# Altium project PCB_Project1.PrjPCB
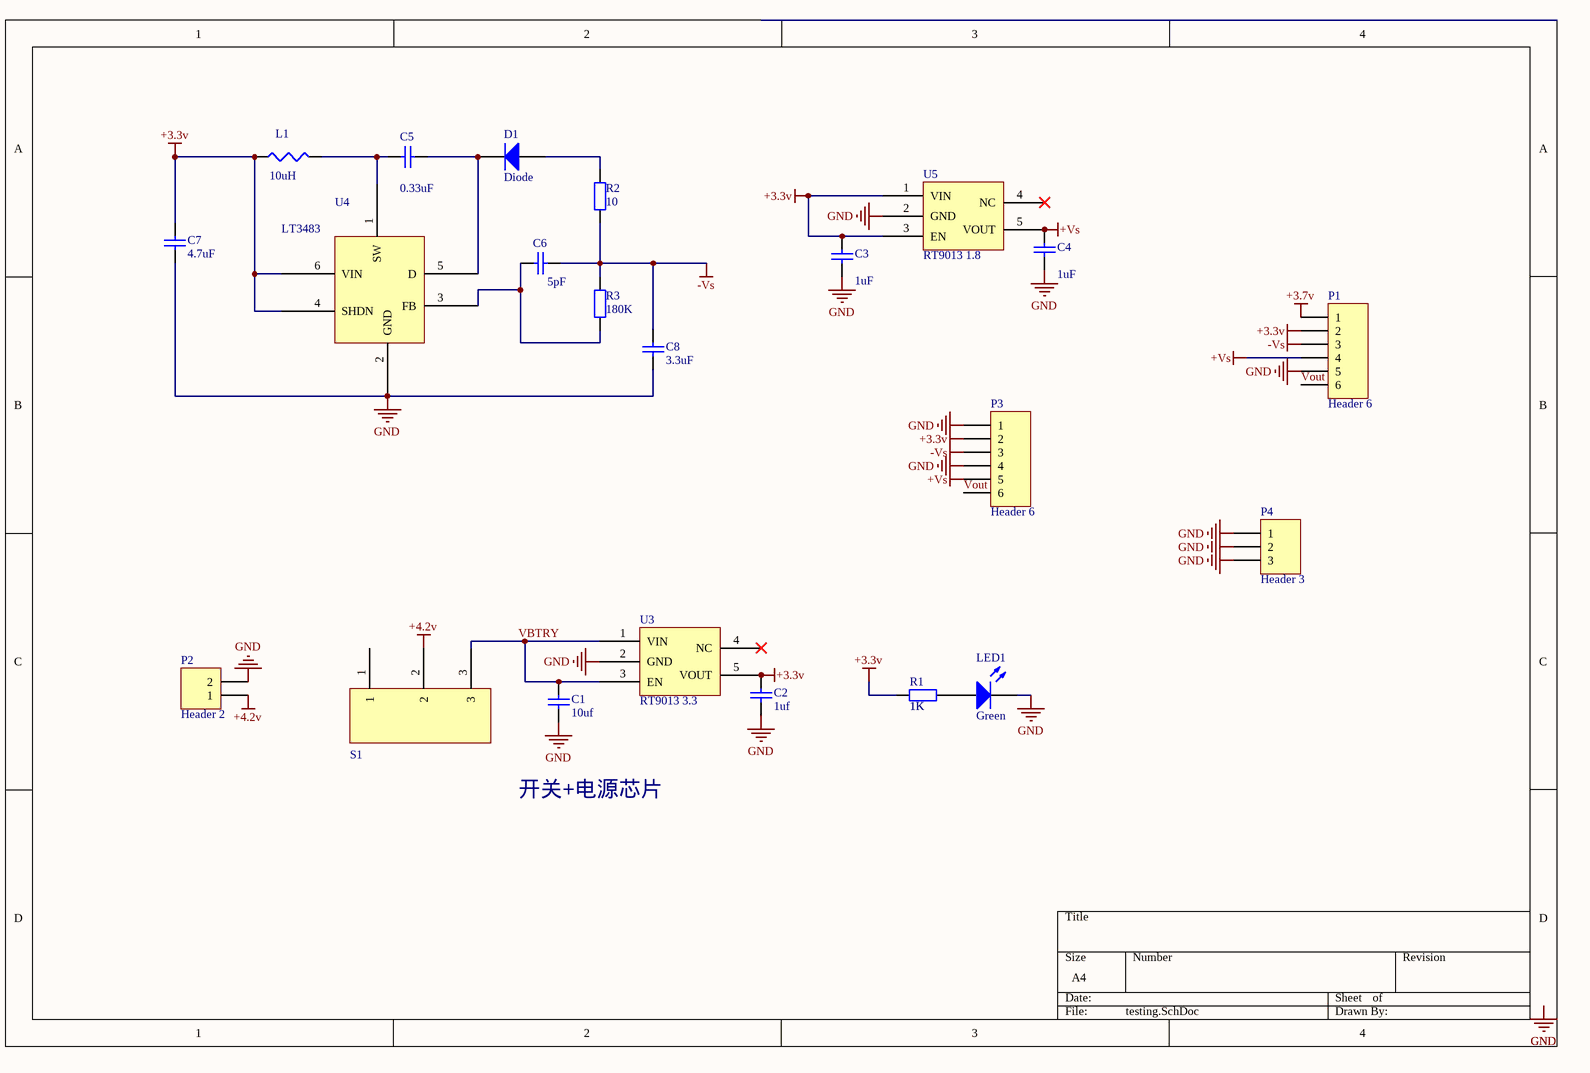
[diagram p0: testing.SchDoc]
1 sheet, 22 parts. Net scope: global (net labels, ports and power ports of the same name join across sheets).
Board file: testing.PcbDoc

## Sheet testing.SchDoc
size A4

### Parts
C1  10uf  [0805]
C2  1uf  [0805]
C3  value 1uF  [0805]
C4  value 1uF  [0805]
C5  value 0.33uF  [0805]  (hidden comment: Cap Semi)
C6  value 5pF  [0805]  (hidden comment: Cap Semi)
C7  value 4.7uF  [0805]  (hidden comment: Cap Semi)
C8  value 3.3uF  [0805]  (hidden comment: Cap Semi)
D1  Diode  [D0402]
L1  value 10uH  [0402 - MI]  (hidden comment: Res3)
LED1  Green  [0805]
P1  Header 6  [6P_0.5mm(FPC) - duplicate - duplicate]
P2  Header 2  [HDR1X2]
P3  Header 6  [HDR1X6]
P4  Header 3  [HDR1X3]
R1  1K  [0805]
R2  10  [0805]
R3  180K  [0805]
S1  (no value)  [HDR1X3]
U3  RT9013 3.3  [SOT23-5AM]
U4  LT3483  [LT3843]
U5  RT9013 1.8  [SC-70-5]

### Nets
+3.3v: C2.2 C3.2 C7.2 L1.1 P1.2 P3.2 R1.1 U3.5(VOUT) U4.4(SHDN) U4.6(VIN) U5.1(VIN) U5.3(EN)
+3.7v: P1.1
+4.2v: P2.1 S1.2
+Vs: C4.2 P1.4 P3.5 U5.5(VOUT)
-Vs: C6.2 C8.1 P1.3 P3.3 R2.2 R3.1
GND: C1.1 C2.1 C3.1 C4.1 C7.1 C8.2 LED1.2(K) P1.5 P2.2 P3.1 P3.4 P4.1 P4.2 P4.3 U3.2(GND) U4.2(GND) U5.2(GND)
VBTRY: C1.2 S1.3 U3.1(VIN) U3.3(EN)
Vout: P1.6 P3.6
NetC5_1: C5.1 L1.2 U4.1(SW)
NetC5_2: C5.2 D1.2(K) U4.5(D)
NetC6_1: C6.1 R3.2 U4.3(FB)
NetD1_1: D1.1(A) R2.1
NetLED1_1: LED1.1(A) R1.2

Not connected (* = marked no-connect by the designer): S1 1; U3 4(NC)*; U5 4(NC)*

### Notes on the sheet
- 开关+电源芯片

### Library data of the parts
C1-C4 = Cap: Capacitor; Published: 8-Jun-2000; LatestRevisionDate: 17-Jul-2002; LatestRevisionNote: Re-released for DXP Platform.; PackageReference: RAD-0.3; Publisher: Altium Limited
  C1: Value: 10uF
  C2: Value: 1uF
C5-C8 = Cap Semi: Capacitor (Semiconductor SIM Model); Published: 8-Jun-2000; LatestRevisionDate: 29-May-2009; LatestRevisionNote: IPC-7351 Footprint Added.; PackageReference: C1206; Publisher: Altium Limited; PackageDescription: Chip Capacitor
D1 = Diode: Default Diode; Published: 8-Jun-2000; LatestRevisionDate: 17-Jul-2002; LatestRevisionNote: Re-released for DXP Platform.; PackageVersion: Sep-1996; PackageReference: SMC; Publisher: Altium Limited; PackageDescription: DO-214-AB/SMC; 2 C-Bend Leads; Body 7.9 x 5.9 mm, inc. leads (LxW); Code_JEDEC: DO-214-AB
L1 = Res3: Resistor; Published: 8-Jun-2000; LatestRevisionDate: 29-May-2009; LatestRevisionNote: IPC-7351 Footprint Added.; PackageReference: 1608; Publisher: Altium Limited; PackageDescription: Chip Resistor
LED1 = LED0: Typical INFRARED GaAs LED; Published: 8-Jun-2000; LatestRevisionDate: 08-Jul-2005; LatestRevisionNote: Mech Layer 1 removed.; PackageReference: LED-0; Publisher: Altium Limited
P1 P3 = Header 6: Header, 6-Pin; LatestRevisionDate: 17-Jul-2002; LatestRevisionNote: Re-released for DXP Platform.; Publisher: Altium Limited
P2 = Header 2: Header, 2-Pin; LatestRevisionDate: 17-Jul-2002; LatestRevisionNote: Re-released for DXP Platform.; Publisher: Altium Limited
P4 = Header 3: Header, 3-Pin; LatestRevisionDate: 17-Jul-2002; LatestRevisionNote: Re-released for DXP Platform.; Publisher: Altium Limited
R1-R3 = Res2: Resistor; Published: 8-Jun-2000; LatestRevisionDate: 17-Jul-2002; LatestRevisionNote: Re-released for DXP Platform.; PackageReference: AXIAL-0.4; Publisher: Altium Limited
  R1: Value: 1K
S1 = Switch
U3 U5 = RT9013 SOT235